# Altium schematic sheet 00_PCH_MainBoard.SchDoc: Mainboard block diagram
size A3; SheetNumber: 4; SheetTotal: 13
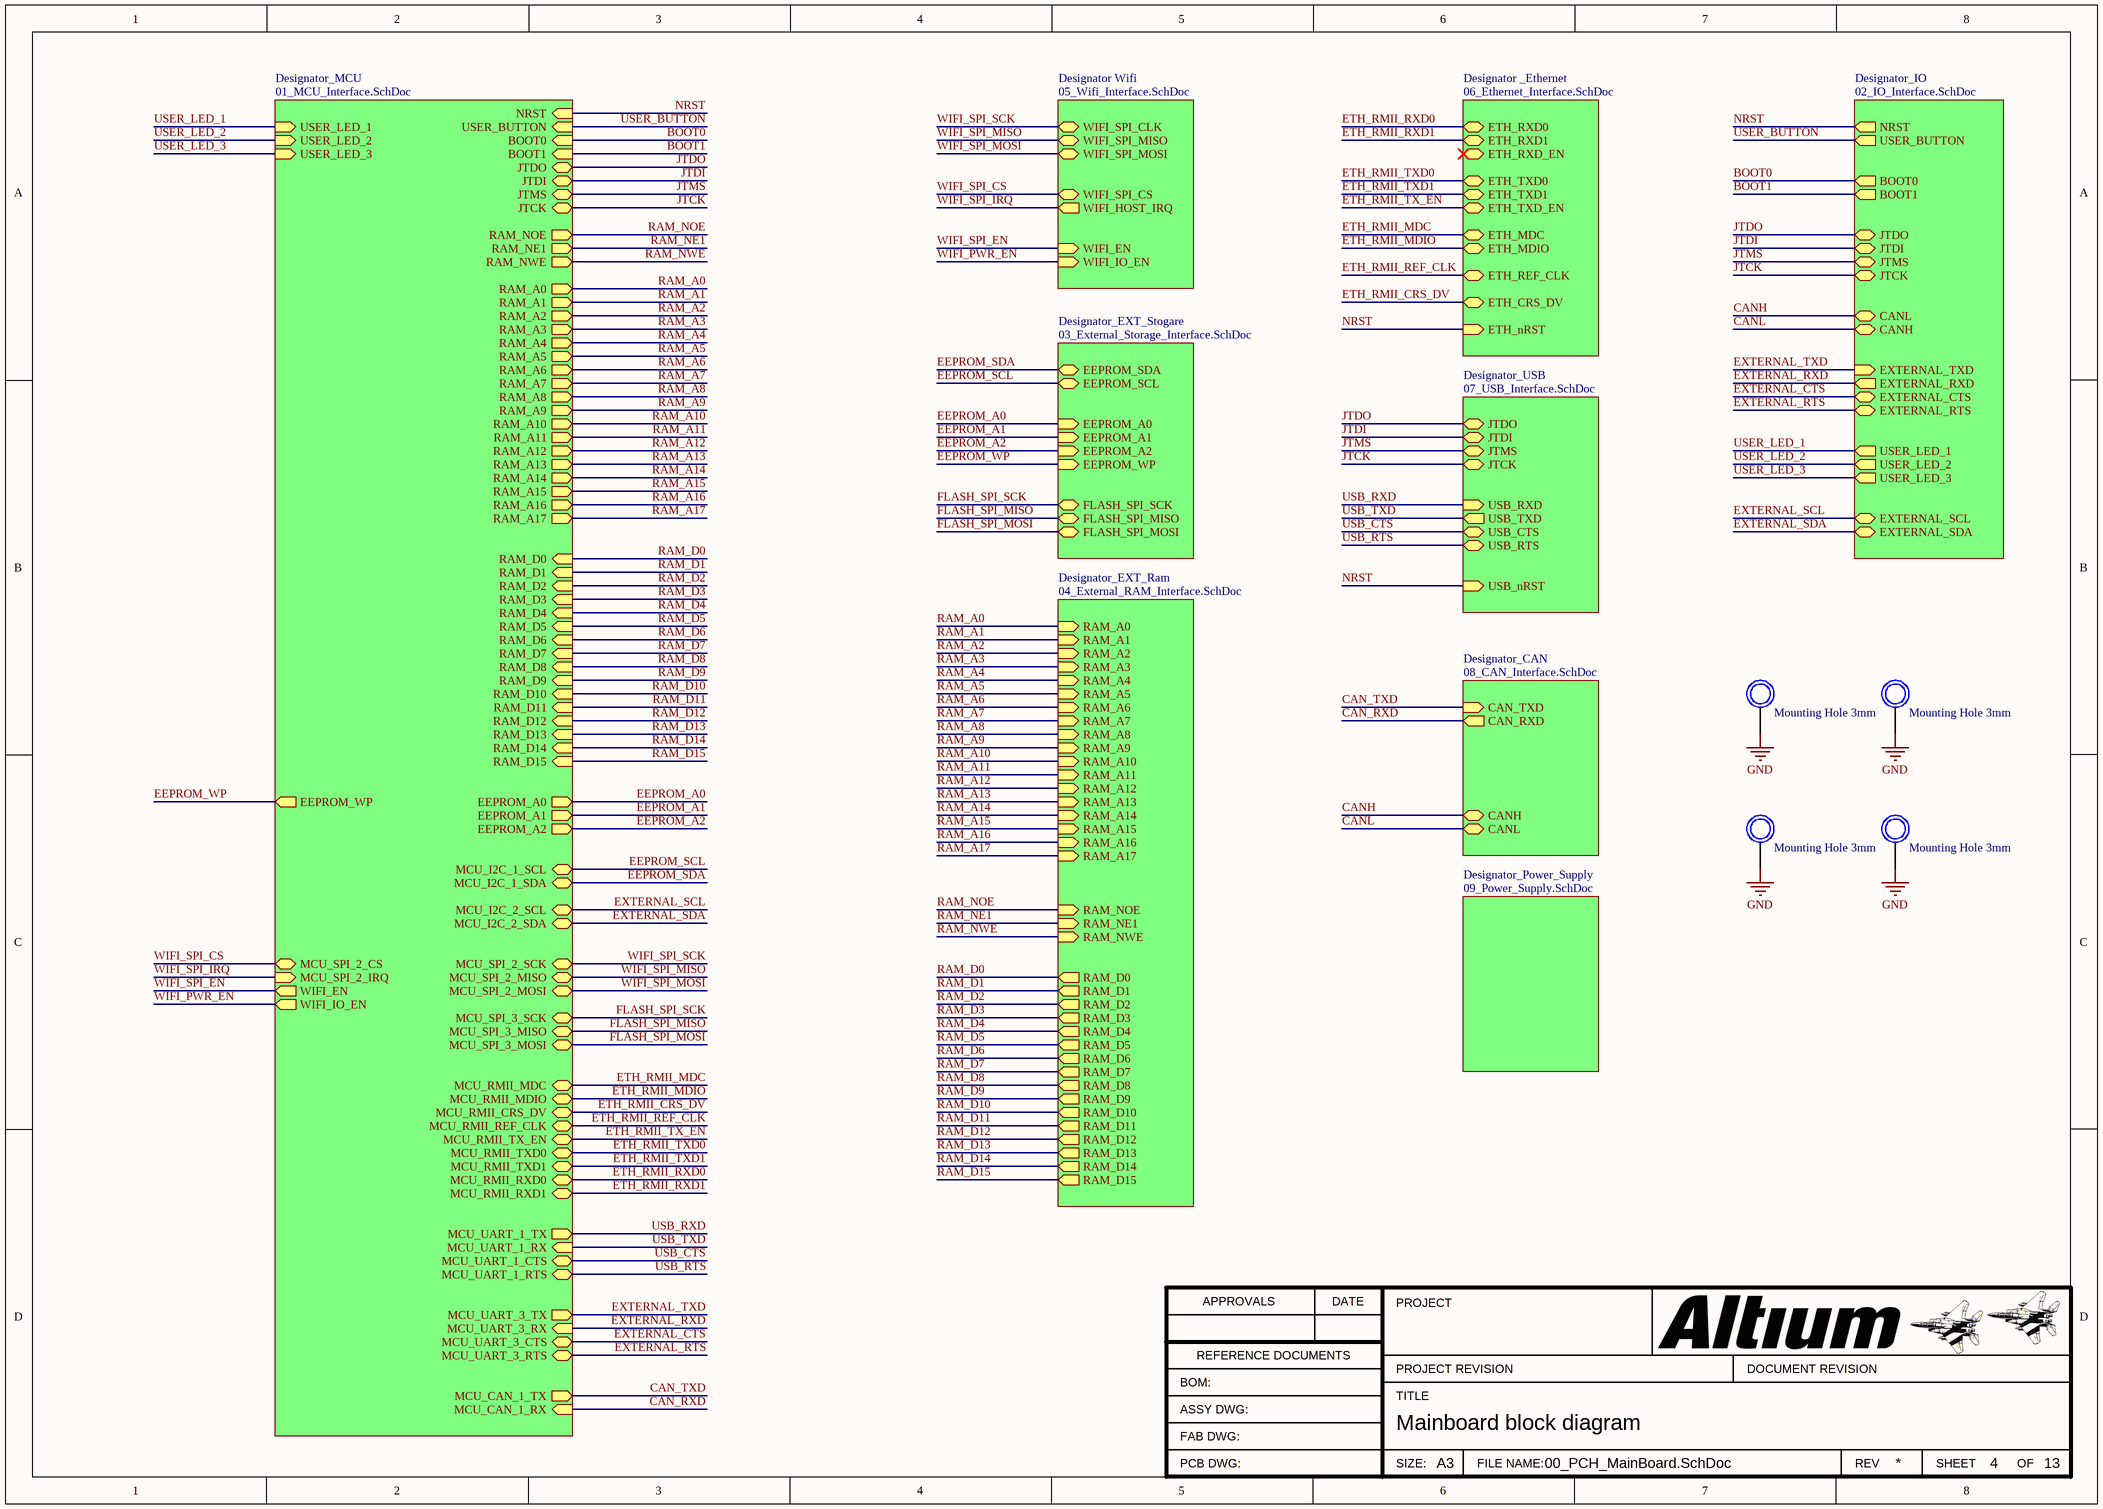
[diagram p0: 00_PCH_MainBoard.SchDoc]

## Parts
H1  Mounting Hole 3mm  [3mm with via]
H2  Mounting Hole 3mm  [3mm with via]
H3  Mounting Hole 3mm  [3mm with via]
H4  Mounting Hole 3mm  [3mm with via]

## Sub-sheets
Designator _Ethernet = 06_Ethernet_Interface.SchDoc: ETH_RXD1 (bidir), ETH_RXD0 (bidir), ETH_TXD1 (bidir), ETH_TXD0 (bidir), ETH_MDC (bidir), ETH_MDIO (bidir), ETH_REF_CLK (bidir), ETH_nRST (in), ETH_TXD_EN (bidir), ETH_RXD_EN (bidir), ETH_CRS_DV (bidir)
Designator Wifi = 05_Wifi_Interface.SchDoc: WIFI_SPI_CLK (bidir), WIFI_SPI_CS (bidir), WIFI_SPI_MOSI (bidir), WIFI_SPI_MISO (bidir), WIFI_HOST_IRQ (out), WIFI_EN (in), WIFI_IO_EN (in)
Designator_CAN = 08_CAN_Interface.SchDoc: CAN_RXD (out), CAN_TXD (in), CANH (bidir), CANL (bidir)
Designator_EXT_Ram = 04_External_RAM_Interface.SchDoc: RAM_A0 (in), RAM_A1 (in), RAM_A2 (in), RAM_A3 (in), RAM_A4 (in), RAM_A5 (in), RAM_A6 (in), RAM_A7 (in), RAM_A8 (in), RAM_A9 (in), RAM_A10 (in), RAM_A11 (in), RAM_A12 (in), RAM_A13 (in), RAM_A14 (in), RAM_A15 (in), RAM_A16 (in), RAM_A17 (in), RAM_NOE (in), RAM_NWE (in), RAM_D0 (out), RAM_D1 (out), RAM_D2 (out), RAM_D3 (out), RAM_D4 (out), RAM_D5 (out), RAM_D6 (out), RAM_D7 (out), RAM_D8 (out), RAM_D9 (out), RAM_D10 (out), RAM_D11 (out), RAM_D12 (out), RAM_D13 (out), RAM_D14 (out), RAM_D15 (out), RAM_NE1 (in)
Designator_EXT_Stogare = 03_External_Storage_Interface.SchDoc: EEPROM_A0 (in), EEPROM_A1 (in), EEPROM_A2 (in), EEPROM_WP (in), EEPROM_SDA (bidir), EEPROM_SCL (bidir), FLASH_SPI_MISO (bidir), FLASH_SPI_MOSI (bidir), FLASH_SPI_SCK (bidir)
Designator_IO = 02_IO_Interface.SchDoc: NRST (out), BOOT1 (out), BOOT0 (out), JTDO (bidir), JTDI (bidir), JTMS (bidir), JTCK (bidir), USER_BUTTON (out), CANL (bidir), CANH (bidir), EXTERNAL_RXD (out), EXTERNAL_TXD (in), EXTERNAL_CTS (bidir), EXTERNAL_RTS (bidir), USER_LED_1 (out), USER_LED_2 (out), USER_LED_3 (out), EXTERNAL_SCL (bidir), EXTERNAL_SDA (bidir)
Designator_MCU = 01_MCU_Interface.SchDoc: NRST (in), BOOT1 (in), BOOT0 (in), JTDO (bidir), JTDI (bidir), JTMS (bidir), JTCK (bidir), RAM_A0 (out), RAM_A6 (out), RAM_A12 (out), RAM_A16 (out), RAM_A17 (out), RAM_D0 (in), RAM_D1 (in), RAM_D2 (in), RAM_D3 (in), RAM_D4 (in), RAM_D10 (in), RAM_D13 (in), RAM_D14 (in), RAM_D15 (in), RAM_A1 (out), RAM_A2 (out), RAM_A3 (out), RAM_A4 (out), RAM_A5 (out), RAM_D11 (in), RAM_D12 (in), RAM_D5 (in), RAM_D6 (in), RAM_D7 (in), RAM_D8 (in), RAM_D9 (in), RAM_A7 (out), RAM_A8 (out), RAM_A9 (out), RAM_A10 (out), RAM_A11 (out), RAM_A13 (out), RAM_A14 (out), RAM_A15 (out), EEPROM_A0 (out), EEPROM_A1 (out), EEPROM_A2 (out), RAM_NOE (out), RAM_NWE (out), USER_BUTTON (in), MCU_I2C_2_SCL (bidir), MCU_I2C_2_SDA (bidir), MCU_SPI_2_SCK (bidir), MCU_SPI_2_MISO (bidir), MCU_I2C_1_SCL (bidir), MCU_I2C_1_SDA (bidir), MCU_SPI_2_MOSI (bidir), MCU_CAN_1_TX (out), MCU_CAN_1_RX (in), MCU_SPI_3_SCK (bidir), MCU_SPI_3_MISO (bidir), MCU_SPI_3_MOSI (bidir), MCU_RMII_MDC (bidir), MCU_RMII_REF_CLK (bidir), MCU_RMII_MDIO (bidir), MCU_UART_3_RX (in), MCU_UART_3_TX (out), MCU_RMII_CRS_DV (bidir), MCU_UART_3_CTS (bidir), MCU_UART_3_RTS (bidir), MCU_UART_1_RX (in), MCU_UART_1_TX (out), MCU_UART_1_CTS (bidir), MCU_UART_1_RTS (bidir), RAM_NE1 (out), MCU_RMII_TX_EN (bidir), MCU_RMII_TXD1 (bidir), MCU_RMII_TXD0 (bidir), MCU_RMII_RXD0 (bidir), MCU_RMII_RXD1 (bidir), MCU_SPI_2_CS (bidir), MCU_SPI_2_IRQ (in), USER_LED_1 (in), USER_LED_2 (in), USER_LED_3 (in), EEPROM_WP (out), WIFI_EN (out), WIFI_IO_EN (out)
Designator_Power_Supply = 09_Power_Supply.SchDoc: no entries
Designator_USB = 07_USB_Interface.SchDoc: USB_nRST (in), JTDO (bidir), JTDI (bidir), JTMS (bidir), JTCK (bidir), USB_RXD (in), USB_TXD (out), USB_CTS (bidir), USB_RTS (bidir)

## Nets
BOOT0: sheet Designator_MCU/BOOT0, sheet Designator_IO/BOOT0
BOOT1: sheet Designator_MCU/BOOT1, sheet Designator_IO/BOOT1
CAN_RXD: sheet Designator_MCU/MCU_CAN_1_RX, sheet Designator_CAN/CAN_RXD
CAN_TXD: sheet Designator_MCU/MCU_CAN_1_TX, sheet Designator_CAN/CAN_TXD
CANH: sheet Designator_IO/CANL, sheet Designator_CAN/CANH
CANL: sheet Designator_IO/CANH, sheet Designator_CAN/CANL
EEPROM_A0: sheet Designator_MCU/EEPROM_A0, sheet Designator_EXT_Stogare/EEPROM_A0
EEPROM_A1: sheet Designator_MCU/EEPROM_A1, sheet Designator_EXT_Stogare/EEPROM_A1
EEPROM_A2: sheet Designator_MCU/EEPROM_A2, sheet Designator_EXT_Stogare/EEPROM_A2
EEPROM_SCL: sheet Designator_MCU/MCU_I2C_1_SCL, sheet Designator_EXT_Stogare/EEPROM_SCL
EEPROM_SDA: sheet Designator_MCU/MCU_I2C_1_SDA, sheet Designator_EXT_Stogare/EEPROM_SDA
EEPROM_WP: sheet Designator_MCU/EEPROM_WP, sheet Designator_EXT_Stogare/EEPROM_WP
ETH_RMII_CRS_DV: sheet Designator_MCU/MCU_RMII_CRS_DV, sheet Designator _Ethernet/ETH_CRS_DV
ETH_RMII_MDC: sheet Designator_MCU/MCU_RMII_MDC, sheet Designator _Ethernet/ETH_MDC
ETH_RMII_MDIO: sheet Designator_MCU/MCU_RMII_MDIO, sheet Designator _Ethernet/ETH_MDIO
ETH_RMII_REF_CLK: sheet Designator_MCU/MCU_RMII_REF_CLK, sheet Designator _Ethernet/ETH_REF_CLK
ETH_RMII_RXD0: sheet Designator_MCU/MCU_RMII_RXD0, sheet Designator _Ethernet/ETH_RXD0
ETH_RMII_RXD1: sheet Designator_MCU/MCU_RMII_RXD1, sheet Designator _Ethernet/ETH_RXD1
ETH_RMII_TX_EN: sheet Designator_MCU/MCU_RMII_TX_EN, sheet Designator _Ethernet/ETH_TXD_EN
ETH_RMII_TXD0: sheet Designator_MCU/MCU_RMII_TXD0, sheet Designator _Ethernet/ETH_TXD0
ETH_RMII_TXD1: sheet Designator_MCU/MCU_RMII_TXD1, sheet Designator _Ethernet/ETH_TXD1
EXTERNAL_CTS: sheet Designator_MCU/MCU_UART_3_CTS, sheet Designator_IO/EXTERNAL_CTS
EXTERNAL_RTS: sheet Designator_MCU/MCU_UART_3_RTS, sheet Designator_IO/EXTERNAL_RTS
EXTERNAL_RXD: sheet Designator_MCU/MCU_UART_3_RX, sheet Designator_IO/EXTERNAL_RXD
EXTERNAL_SCL: sheet Designator_MCU/MCU_I2C_2_SCL, sheet Designator_IO/EXTERNAL_SCL
EXTERNAL_SDA: sheet Designator_MCU/MCU_I2C_2_SDA, sheet Designator_IO/EXTERNAL_SDA
EXTERNAL_TXD: sheet Designator_MCU/MCU_UART_3_TX, sheet Designator_IO/EXTERNAL_TXD
FLASH_SPI_MISO: sheet Designator_MCU/MCU_SPI_3_MISO, sheet Designator_EXT_Stogare/FLASH_SPI_MISO
FLASH_SPI_MOSI: sheet Designator_MCU/MCU_SPI_3_MOSI, sheet Designator_EXT_Stogare/FLASH_SPI_MOSI
FLASH_SPI_SCK: sheet Designator_MCU/MCU_SPI_3_SCK, sheet Designator_EXT_Stogare/FLASH_SPI_SCK
JTCK: sheet Designator_MCU/JTCK, sheet Designator_IO/JTCK, sheet Designator_USB/JTCK
JTDI: sheet Designator_MCU/JTDI, sheet Designator_IO/JTDI, sheet Designator_USB/JTDI
JTDO: sheet Designator_MCU/JTDO, sheet Designator_IO/JTDO, sheet Designator_USB/JTDO
JTMS: sheet Designator_MCU/JTMS, sheet Designator_IO/JTMS, sheet Designator_USB/JTMS
NRST: sheet Designator_MCU/NRST, sheet Designator_IO/NRST, sheet Designator _Ethernet/ETH_nRST, sheet Designator_USB/USB_nRST
RAM_A0: sheet Designator_MCU/RAM_A0, sheet Designator_EXT_Ram/RAM_A0
RAM_A1: sheet Designator_MCU/RAM_A1, sheet Designator_EXT_Ram/RAM_A1
RAM_A2: sheet Designator_MCU/RAM_A2, sheet Designator_EXT_Ram/RAM_A2
RAM_A3: sheet Designator_MCU/RAM_A3, sheet Designator_EXT_Ram/RAM_A3
RAM_A4: sheet Designator_MCU/RAM_A4, sheet Designator_EXT_Ram/RAM_A4
RAM_A5: sheet Designator_MCU/RAM_A5, sheet Designator_EXT_Ram/RAM_A5
RAM_A6: sheet Designator_MCU/RAM_A6, sheet Designator_EXT_Ram/RAM_A6
RAM_A7: sheet Designator_MCU/RAM_A7, sheet Designator_EXT_Ram/RAM_A7
RAM_A8: sheet Designator_MCU/RAM_A8, sheet Designator_EXT_Ram/RAM_A8
RAM_A9: sheet Designator_MCU/RAM_A9, sheet Designator_EXT_Ram/RAM_A9
RAM_A10: sheet Designator_MCU/RAM_A10, sheet Designator_EXT_Ram/RAM_A10
RAM_A11: sheet Designator_MCU/RAM_A11, sheet Designator_EXT_Ram/RAM_A11
RAM_A12: sheet Designator_MCU/RAM_A12, sheet Designator_EXT_Ram/RAM_A12
RAM_A13: sheet Designator_MCU/RAM_A13, sheet Designator_EXT_Ram/RAM_A13
RAM_A14: sheet Designator_MCU/RAM_A14, sheet Designator_EXT_Ram/RAM_A14
RAM_A15: sheet Designator_MCU/RAM_A15, sheet Designator_EXT_Ram/RAM_A15
RAM_A16: sheet Designator_MCU/RAM_A16, sheet Designator_EXT_Ram/RAM_A16
RAM_A17: sheet Designator_MCU/RAM_A17, sheet Designator_EXT_Ram/RAM_A17
RAM_D0: sheet Designator_MCU/RAM_D0, sheet Designator_EXT_Ram/RAM_D0
RAM_D1: sheet Designator_MCU/RAM_D1, sheet Designator_EXT_Ram/RAM_D1
RAM_D2: sheet Designator_MCU/RAM_D2, sheet Designator_EXT_Ram/RAM_D2
RAM_D3: sheet Designator_MCU/RAM_D3, sheet Designator_EXT_Ram/RAM_D3
RAM_D4: sheet Designator_MCU/RAM_D4, sheet Designator_EXT_Ram/RAM_D4
RAM_D5: sheet Designator_MCU/RAM_D5, sheet Designator_EXT_Ram/RAM_D5
RAM_D6: sheet Designator_MCU/RAM_D6, sheet Designator_EXT_Ram/RAM_D6
RAM_D7: sheet Designator_MCU/RAM_D7, sheet Designator_EXT_Ram/RAM_D7
RAM_D8: sheet Designator_MCU/RAM_D8, sheet Designator_EXT_Ram/RAM_D8
RAM_D9: sheet Designator_MCU/RAM_D9, sheet Designator_EXT_Ram/RAM_D9
RAM_D10: sheet Designator_MCU/RAM_D10, sheet Designator_EXT_Ram/RAM_D10
RAM_D11: sheet Designator_MCU/RAM_D11, sheet Designator_EXT_Ram/RAM_D11
RAM_D12: sheet Designator_MCU/RAM_D12, sheet Designator_EXT_Ram/RAM_D12
RAM_D13: sheet Designator_MCU/RAM_D13, sheet Designator_EXT_Ram/RAM_D13
RAM_D14: sheet Designator_MCU/RAM_D14, sheet Designator_EXT_Ram/RAM_D14
RAM_D15: sheet Designator_MCU/RAM_D15, sheet Designator_EXT_Ram/RAM_D15
RAM_NE1: sheet Designator_MCU/RAM_NE1, sheet Designator_EXT_Ram/RAM_NE1
RAM_NOE: sheet Designator_MCU/RAM_NOE, sheet Designator_EXT_Ram/RAM_NOE
RAM_NWE: sheet Designator_MCU/RAM_NWE, sheet Designator_EXT_Ram/RAM_NWE
USB_CTS: sheet Designator_MCU/MCU_UART_1_CTS, sheet Designator_USB/USB_CTS
USB_RTS: sheet Designator_MCU/MCU_UART_1_RTS, sheet Designator_USB/USB_RTS
USB_RXD: sheet Designator_MCU/MCU_UART_1_TX, sheet Designator_USB/USB_RXD
USB_TXD: sheet Designator_MCU/MCU_UART_1_RX, sheet Designator_USB/USB_TXD
USER_BUTTON: sheet Designator_MCU/USER_BUTTON, sheet Designator_IO/USER_BUTTON
USER_LED_1: sheet Designator_MCU/USER_LED_1, sheet Designator_IO/USER_LED_1
USER_LED_2: sheet Designator_MCU/USER_LED_2, sheet Designator_IO/USER_LED_2
USER_LED_3: sheet Designator_MCU/USER_LED_3, sheet Designator_IO/USER_LED_3
WIFI_PWR_EN: sheet Designator_MCU/WIFI_IO_EN, sheet Designator Wifi/WIFI_IO_EN
WIFI_SPI_CS: sheet Designator_MCU/MCU_SPI_2_CS, sheet Designator Wifi/WIFI_SPI_CS
WIFI_SPI_EN: sheet Designator_MCU/WIFI_EN, sheet Designator Wifi/WIFI_EN
WIFI_SPI_IRQ: sheet Designator_MCU/MCU_SPI_2_IRQ, sheet Designator Wifi/WIFI_HOST_IRQ
WIFI_SPI_MISO: sheet Designator_MCU/MCU_SPI_2_MISO, sheet Designator Wifi/WIFI_SPI_MISO
WIFI_SPI_MOSI: sheet Designator_MCU/MCU_SPI_2_MOSI, sheet Designator Wifi/WIFI_SPI_MOSI
WIFI_SPI_SCK: sheet Designator_MCU/MCU_SPI_2_SCK, sheet Designator Wifi/WIFI_SPI_CLK

Not connected (* = marked no-connect by the designer): H1 0; H2 0; H3 0; H4 0

## Notes on the sheet
- Labels drawn without touching a wire or pin: GND
- APPROVALS
- DATE
- PROJECT
- BOM:
- REFERENCE DOCUMENTS
- TITLE
- PROJECT REVISION
- DOCUMENT REVISION
- ASSY DWG:
- FAB DWG:
- PCB DWG:
- SIZE:
- A3
- FILE NAME:
- REV
- SHEET
- OF